# Altium schematic sheet Vref.SchDoc
size A2
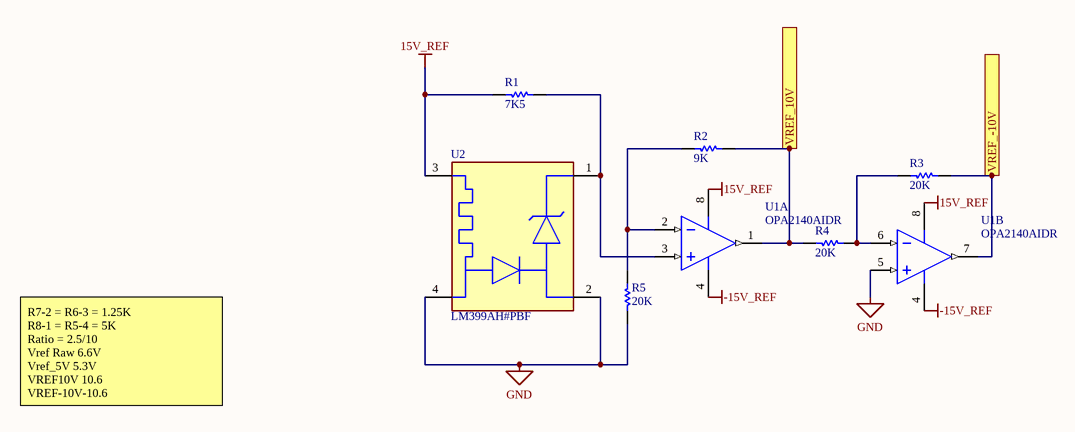
[diagram p0: Vref.SchDoc]

## Parts
R1  7K5  [RESC2013X60X35ML10T20]
R2  9K  [RESC2013X60X35ML10T20]
R3  20K  [RESC2013X60X35ML10T20]
R4  20K  [RESC2013X60X35ML10T20]
R5  20K  [RESC2013X60X35ML10T20]
U1  OPA2140AIDR  [D0008A_M]  (parts A,B of 2)
U2  LM399AH#PBF  [FP-H-4-05-08-1341-MFG]

## Ports
VREF_10V (out), VREF_-10V (out)

## Nets
15V_REF: R1.2 U1.8(V+) U2.3
-15V_REF: U1.4(V-)
GND: R5.2 U1.5(IN_B+) U2.2 U2.4
VREF_10V: R2.2 R4.1 U1.1(OUT_A) ; port VREF_10V
VREF_-10V: R3.2 U1.7(OUT_B) ; port VREF_-10V
NetR1_1: R1.1 U1.3(IN_A+) U2.1
NetR2_1: R2.1 R5.1 U1.2(IN_A-)
NetR3_1: R3.1 R4.2 U1.6(IN_B-)

## Notes on the sheet
- R7-2 = R6-3 = 1.25K
  R8-1 = R5-4 = 5K
  Ratio = 2.5/10
  Vref Raw 6.6V
  Vref_5V 5.3V
  VREF10V 10.6
  VREF-10V-10.6

## Library data of the parts
R1-R5 = CMP-2100-03671-1: Chip Resistor, 1 KOhm, +/- 1%, 125 mW, -55 to 155 degC, 0805 (2012 Metric), RoHS, Tape and Reel; Manufacturer: Yageo; Temperature Coefficient: 100ppm/degreesC; Voltage Rating (DC): 150V; Max Power Dissipation: 125mW; Resistance: 1KOhm; Number of Pins: 2; Number of Terminations: 2; Datasheet URL: http://www.yageo.com/NewPortal/yageodocoutput?fileName=/pdf/R-Chip/PYu-RC_Group_51_RoHS_L_5.pdf; Length: 0.079inch; Package Description: 2-Pin Surface Mounted Device, Body 2 x 1.25 mm; Depth: 1.25mm; Height: 0.024inch; Military Standard: Not; Case/Package: 0805; Package Reference: 0805; RoHSCompliant: true; Lead Free: LeadFree; Packaging: TapeandReel; Package Quantity: 1; Datasheet Version: Rev. 5, 10/2016; Tolerance: 1%; Min Operating Temperature: -55degC; Voltage Rating: 150V; Composition: ThickFilm; Case Code (Imperial): 0805; Power Rating: 125mW; Width: 0.049inch; Case Code (Metric): 2012; Manufacturer URL: http://www.yageo.com/; Max Operating Temperature: 155degC; REACH SVHC: Unknown; Termination: SMD/SMT
U1 = CMP-0272-00256-3: 11 MHz, Precision, Low Noise, Rail-to-Rail Output, JFET Operational Amplifier, 4.5 to 36 V, -40 to 125 degC, 8-pin SOIC (D8), Green (RoHS & no Sb/Br); Manufacturer: Texas Instruments; Number of Channels: 2; Total Supply Voltage(Min)(+5V is 5, +/-5V is 10): 4.5; Vio (25C)(Max)(mV): 0.12; Total Supply Voltage(Max)(+5V is 5, +/-5V is 10): 36; Offset Drift(Typ)(uV/C): 0.35; IIB(Max)(pA): 10; GBW(Typ)(MHz): 11; Slew Rate(Typ)(V/us): 20; Packing: LARGE T&R; Sub Family: High Supply Voltage Amplifier (>=30V), Low Input Bias Current Amp (<=10pA), Low Noise Amp (<=10nV/rtHz), Low Offset Voltage Amplifier (<=500uV), Precision Amplifier; CMRR(Min)(dB): 126; Rating: Catalog; PackageReference: D0008A; ComponentLink2URL: http://www.ti.com/lit/ds/symlink/opa2140.pdf; ComponentLink1Description: Manufacturer URL; Iq per channel(Max)(mA): 2; Code_JEDEC: MS-012; PartNumber: OPA2140AIDR; Eco-Plan: Green (RoHS & no Sb/Br); ComponentLink3URL: http://www.ti.com/litv/pdf/msoi002j; ComponentLink3Description: Package Specification; ComponentLink1URL: http://www.ti.com/; DatasheetVersion: SBOS498A; PackageVersion: 4040047-3/M, 06/2011; Mounting Technology: Surface Mount; ComponentLink2Description: Datasheet; PackageDescription: 8-Pin Plastic Small Outline, Body 4.9 x 3.9 mm, Pitch 1.27 mm
U2 = CMP-09137-000115-1: IC VREF SHUNT 0.17% TO46-4; Max Output Voltage: 6.95V; Temperature Coefficient: 1ppm/°C; Cathode Current: 500uA; Output Current: 10mA; Number of Channels: 1; Tolerance: 2%; Min Operating Temperature: 0°C; Case/Package: TO-46; Package Quantity: 20; Reference Type: Shunt; Output Voltage: 6.95V; Max Operating Temperature: 70°C; Number of Pins: 4; Mount: Through Hole; Radiation Hardening: No; RoHS Compliant: Yes; Packaging: Rail/Tube